# EasyEDA schematic SCH_PCBBoard_2022-05-29.json
TITLE: SMART STUDY; REV: 1.0; Date: 2022-05-29; Sheet: 1/1; Drawn By: irileylive; Company: Riley Beckett
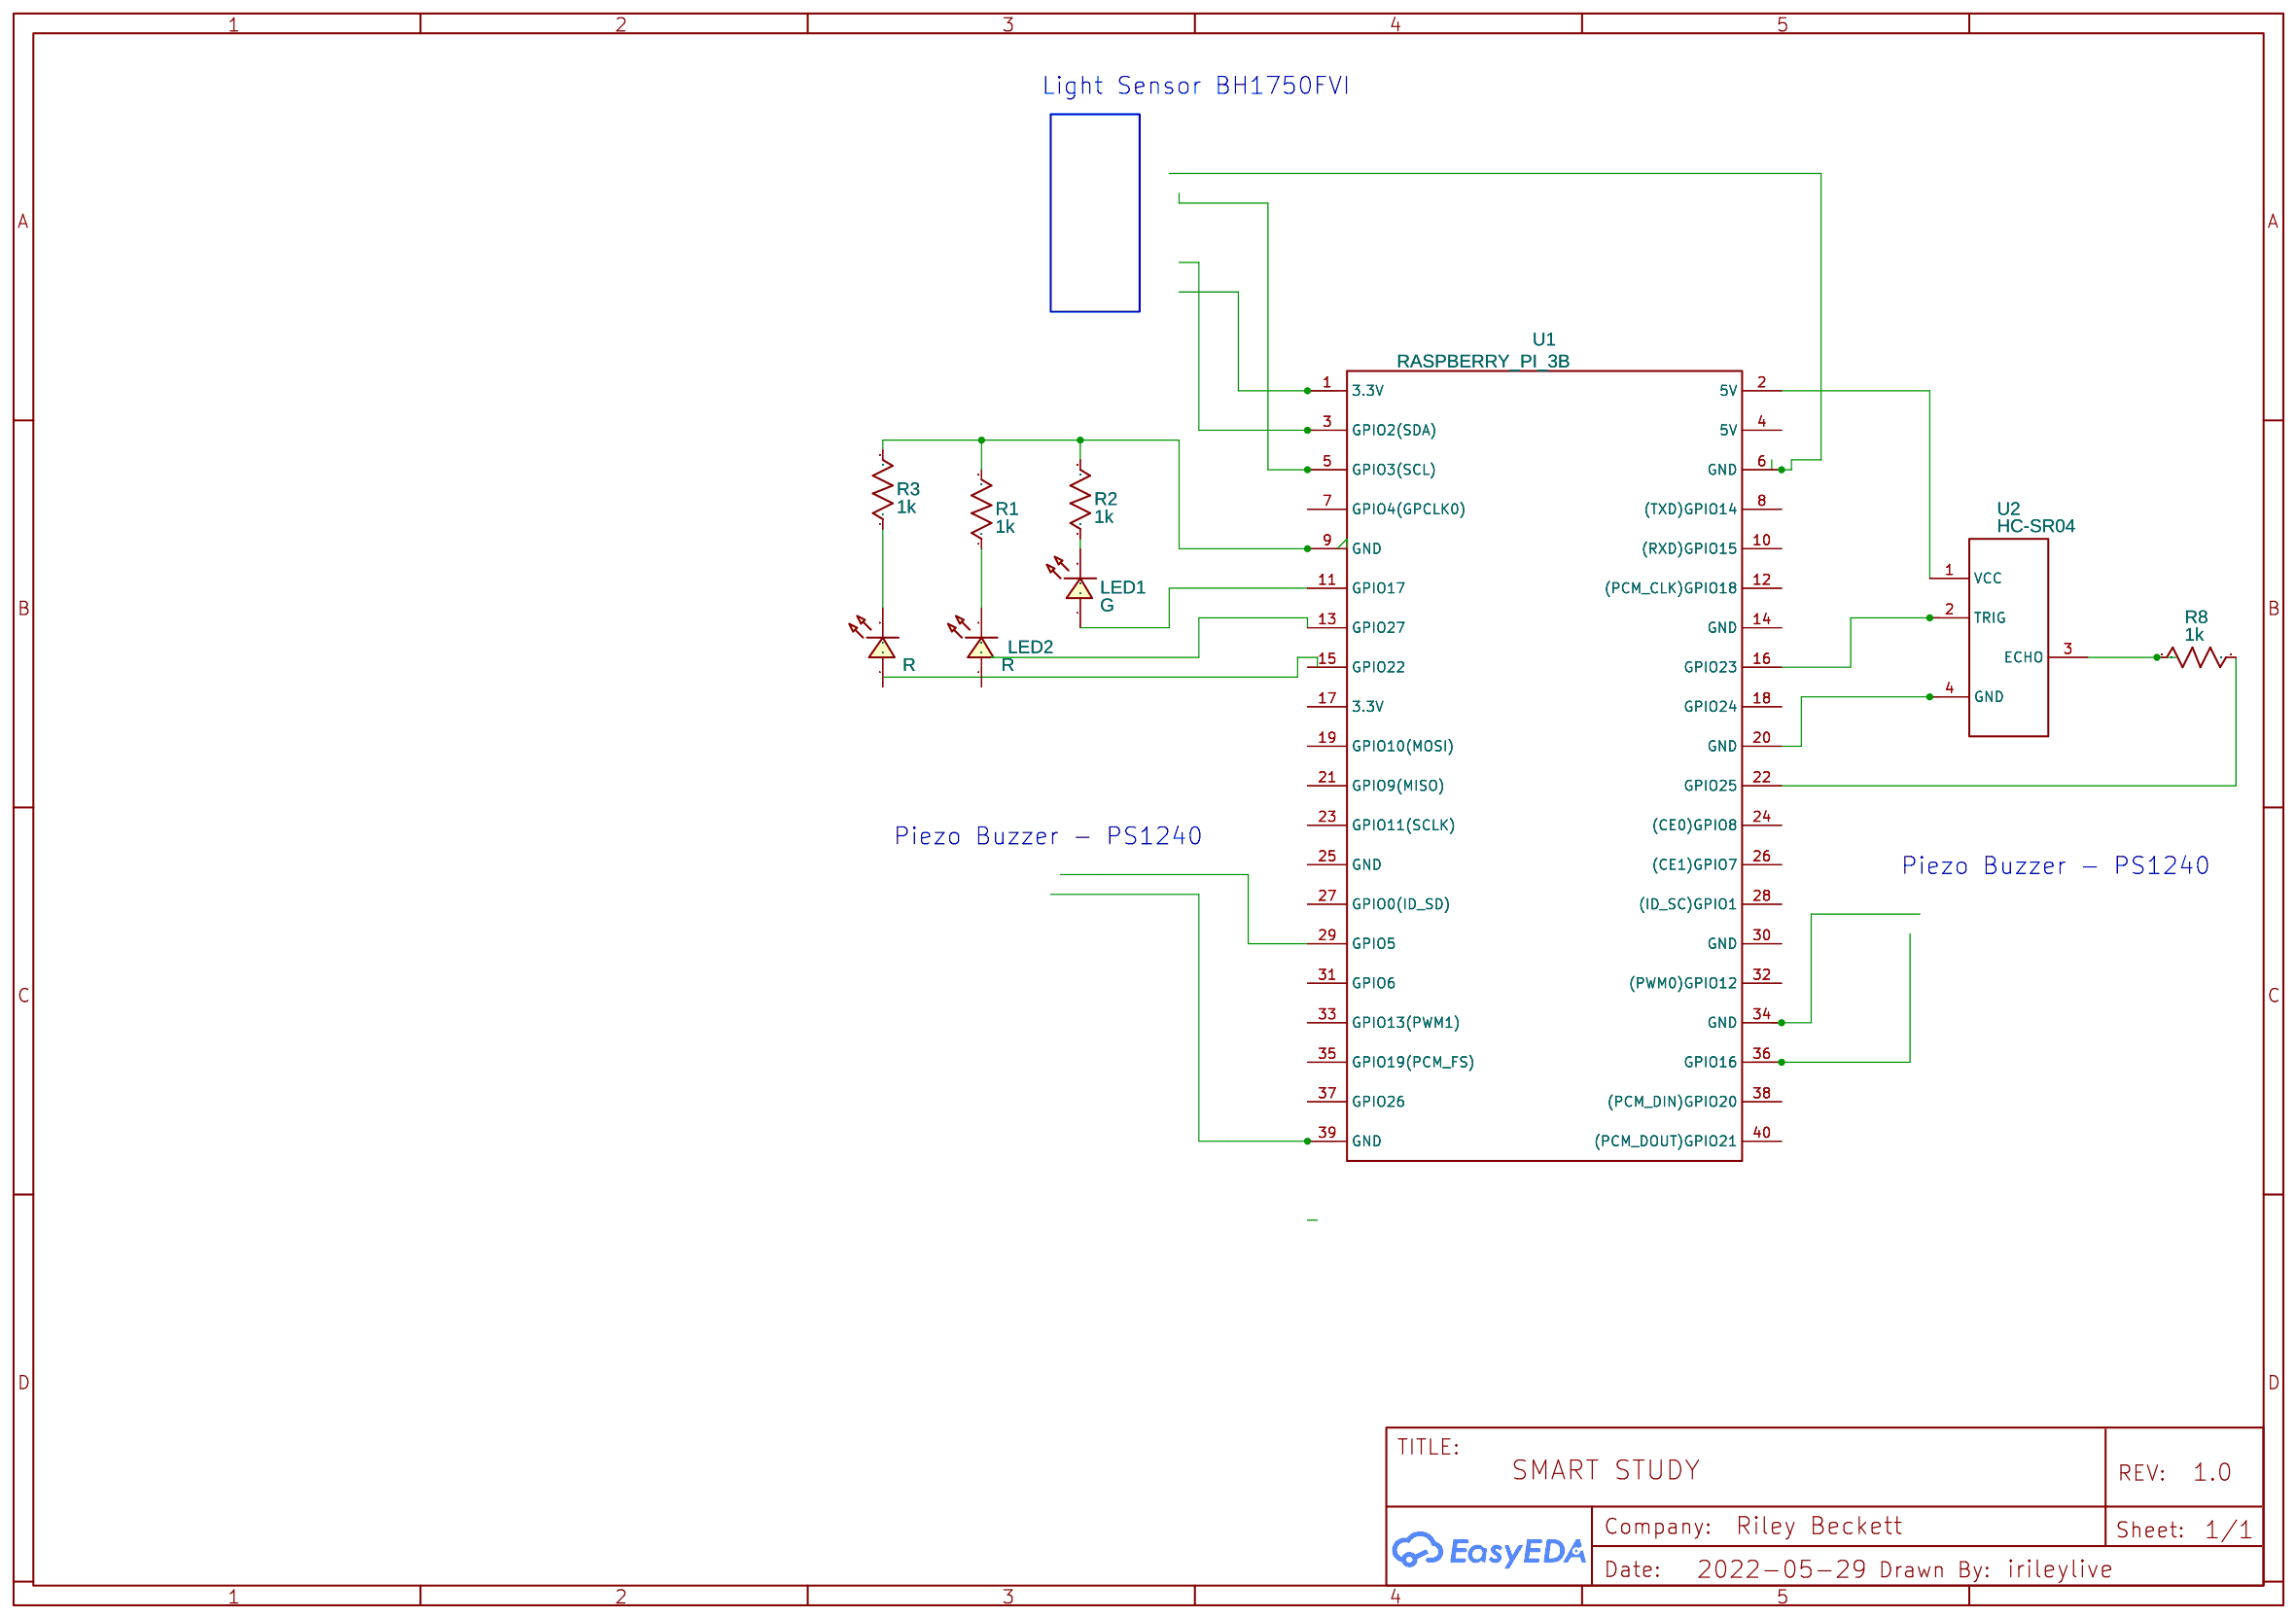
[diagram p0: schematic sheet]

## Parts
LED1  G  [LED-TH_BD3.0_GREEN]
LED2  R  [LED-TH_BD3.0_RED]
LED3  R  [LED-TH_BD3.0_RED]
R1  1k  [R_AXIAL-0.3]
R2  1k  [R_AXIAL-0.3]
R3  1k  [R_AXIAL-0.3]
R8  1k  [R_AXIAL-0.3]
U1  RASPBERRY_PI_3B  [RASPBERRY_PI_3B_PLUS_HAT_BOARD]
U2  HC-SR04

## Library data of the parts
LED1 = LED-TH-3mm_G: Manufacturer: EVERLIGHT(台湾亿光); Manufacturer Part: 204-10SYGD/S530-E3; Supplier Part: C85161; Contributor: LCEDA_Lib
LED2 LED3 = LED-TH-3mm_R: Manufacturer: EVERLIGHT(台湾亿光); Manufacturer Part: 204-10SDRD/S530-A3-L; Supplier Part: C84774; Supplier: LCSC; Contributor: LCEDA_Lib
R1-R3 R8 = R_AXIAL-0.3_US: Contributor: LCEDA_Lib
U1 = RASPBERRY_PI_3B_PLUS_HAT_BOARD: catid: 20; Contributor: lwweb; Manufacturer Part: Raspberry-Pi-3B-Plus-HAT-Board
U2 = HC-SR04: Contributor: Adrian W

## Nets
Net-(LED1-1): LED1.1 U1.11(GPIO17)
Net-(LED1-2): LED1.2 R2.1
Net-(LED2-2): LED2.2 R1.1
Net-(LED3-2): LED3.2 R3.1
Net-(R1-2): R1.2 R2.2 R3.2 U1.9(GND)
Net-(R8-1): R8.1 U1.22(GPIO25)
Net-(R8-2): R8.2 U2.3(ECHO)
Net-(U1-2): U1.2(5V) U2.1(VCC)
Net-(U1-16): U1.16(GPIO23) U2.2(TRIG)
Net-(U1-20): U1.20(GND) U2.4(GND)

Not connected (* = marked no-connect by the designer): LED2 1; LED3 1; U1 1(3.3V) 3(GPIO2(SDA)) 4(5V) 5(GPIO3(SCL)) 6(GND) 7(GPIO4(GPCLK0)) 8((TXD)GPIO14) 10((RXD)GPIO15) 12((PCM_CLK)GPIO18) 13(GPIO27) 14(GND) 15(GPIO22) 17(3.3V) 18(GPIO24) 19(GPIO10(MOSI)) 21(GPIO9(MISO)) 23(GPIO11(SCLK)) 24((CE0)GPIO8) 25(GND) 26((CE1)GPIO7) 27(GPIO0(ID_SD)) 28((ID_SC)GPIO1) 29(GPIO5) 30(GND) 31(GPIO6) 32((PWM0)GPIO12) 33(GPIO13(PWM1)) 34(GND) 35(GPIO19(PCM_FS)) 36(GPIO16) 37(GPIO26) 38((PCM_DIN)GPIO20) 39(GND) 40((PCM_DOUT)GPIO21)

## Notes on the sheet
- Light Sensor BH1750FVI
- Piezo Buzzer - PS1240
- Piezo Buzzer - PS1240
